# EAGLE design aop (EAGLE 6.4)
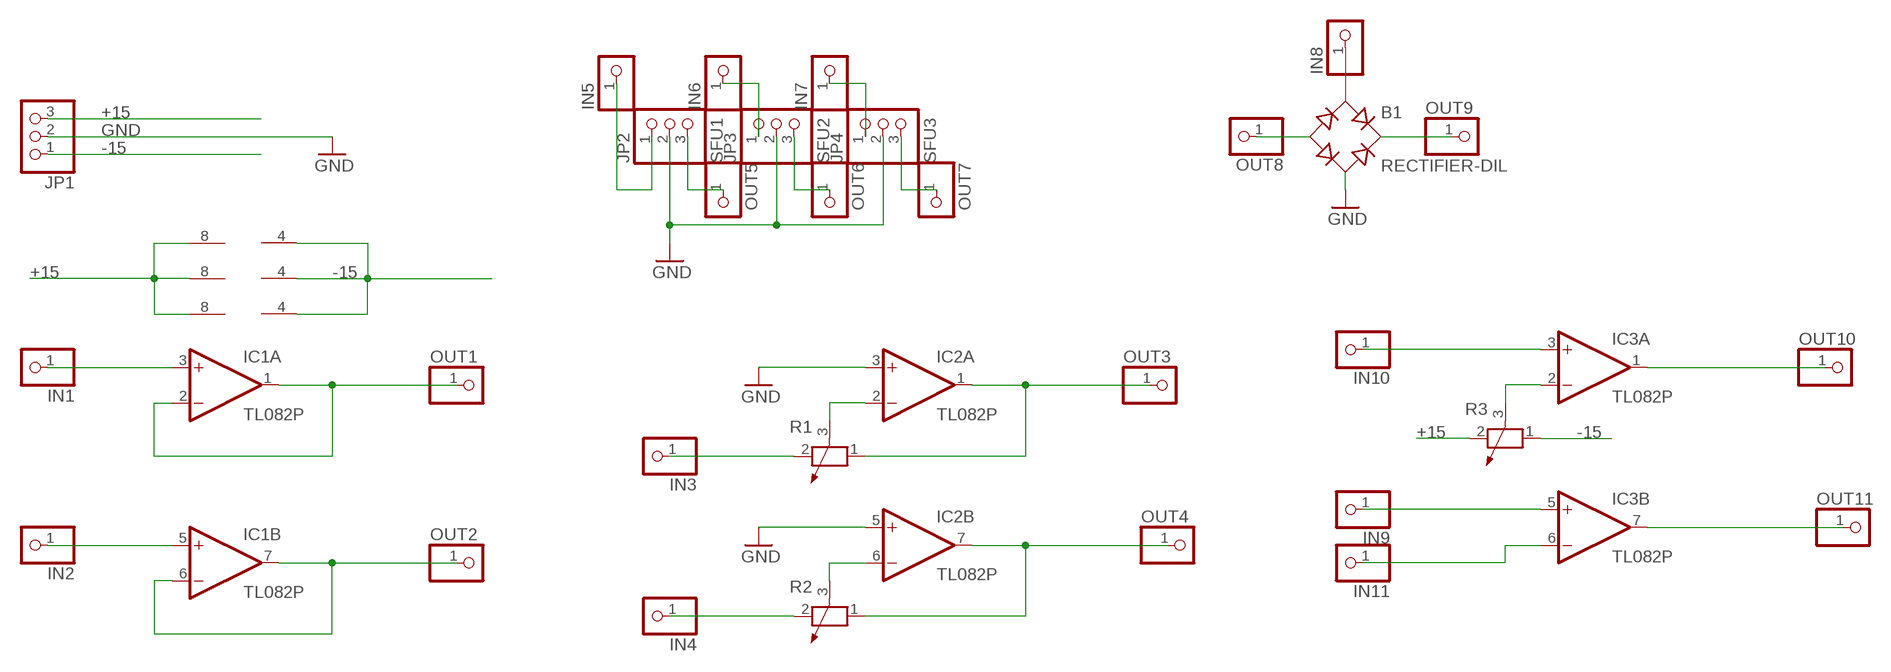
[diagram p0: schematic, sheet 1]

## Parts
B1  RECTIFIER-DIL  [B-DIL]
IC1  TL082P  [DIL08]
IC2  TL082P  [DIL08]
IC3  TL082P  [DIL08]
IN1  PINHD-1X1  [1X01]
IN2  PINHD-1X1  [1X01]
IN3  PINHD-1X1  [1X01]
IN4  PINHD-1X1  [1X01]
IN5  PINHD-1X1  [1X01]
IN6  PINHD-1X1  [1X01]
IN7  PINHD-1X1  [1X01]
IN8  PINHD-1X1  [1X01]
IN9  PINHD-1X1  [1X01]
IN10  PINHD-1X1  [1X01]
IN11  PINHD-1X1  [1X01]
JP1  PINHD-1X3  [1X03]
JP2  SFU1  PINHD-1X3  [1X03]
JP3  SFU2  PINHD-1X3  [1X03]
JP4  SFU3  PINHD-1X3  [1X03]
OUT1  PINHD-1X1  [1X01]
OUT2  PINHD-1X1  [1X01]
OUT3  PINHD-1X1  [1X01]
OUT4  PINHD-1X1  [1X01]
OUT5  PINHD-1X1  [1X01]
OUT6  PINHD-1X1  [1X01]
OUT7  PINHD-1X1  [1X01]
OUT8  PINHD-1X1  [1X01]
OUT9  PINHD-1X1  [1X01]
OUT10  PINHD-1X1  [1X01]
OUT11  PINHD-1X1  [1X01]
R1  POTENTIOMETER_PT-10  [PT-10]
R2  POTENTIOMETER_PT-10  [PT-10]
R3  POTENTIOMETER_PT-10  [PT-10]

## Nets
+15: IC1.8(P:V+) IC2.8(P:V+) IC3.8(P:V+) JP1.3 R3.2
-15: IC1.4(P:V-) IC2.4(P:V-) IC3.4(P:V-) JP1.1 R3.1
GND: B1.AC2 IC2.3(A:+IN) IC2.5(B:+IN) JP1.2 JP2.2 JP3.2 JP4.2
N$1: IC1.1(A:OUT) IC1.2(A:-IN) OUT1.1
N$2: IC1.3(A:+IN) IN1.1
N$3: IC1.5(B:+IN) IN2.1
N$4: IC1.6(B:-IN) IC1.7(B:OUT) OUT2.1
N$5: IC2.1(A:OUT) OUT3.1 R1.1
N$6: IC2.2(A:-IN) R1.3
N$7: IC2.7(B:OUT) OUT4.1 R2.1
N$8: IC2.6(B:-IN) R2.3
N$9: IN3.1 R1.2
N$10: IN4.1 R2.2
N$11: IN5.1 JP2.1
N$12: JP2.3 OUT5.1
N$13: IN6.1 JP3.1
N$14: JP3.3 OUT6.1
N$15: IN7.1 JP4.1
N$16: JP4.3 OUT7.1
N$17: B1.AC1 IN8.1
N$18: IC3.1(A:OUT) OUT10.1
N$19: B1.- OUT8.1
N$20: B1.+ OUT9.1
N$21: IC3.2(A:-IN) R3.3
N$22: IC3.7(B:OUT) OUT11.1
N$23: IC3.6(B:-IN) IN11.1
N$24: IC3.3(A:+IN) IN10.1
N$25: IC3.5(B:+IN) IN9.1

## Library data of the parts
B1 = rectifier:RECTIFIER-: Rectifier
IC1-IC3 = linear:TL082: OP AMP
IN1-IN11 OUT1-OUT11 = pinhead:PINHD-1X1: PIN HEADER
JP1-JP4 = pinhead:PINHD-1X3: PIN HEADER
R1-R3 = rcl:POTENTIOMETER_: Potentiometer

## Board
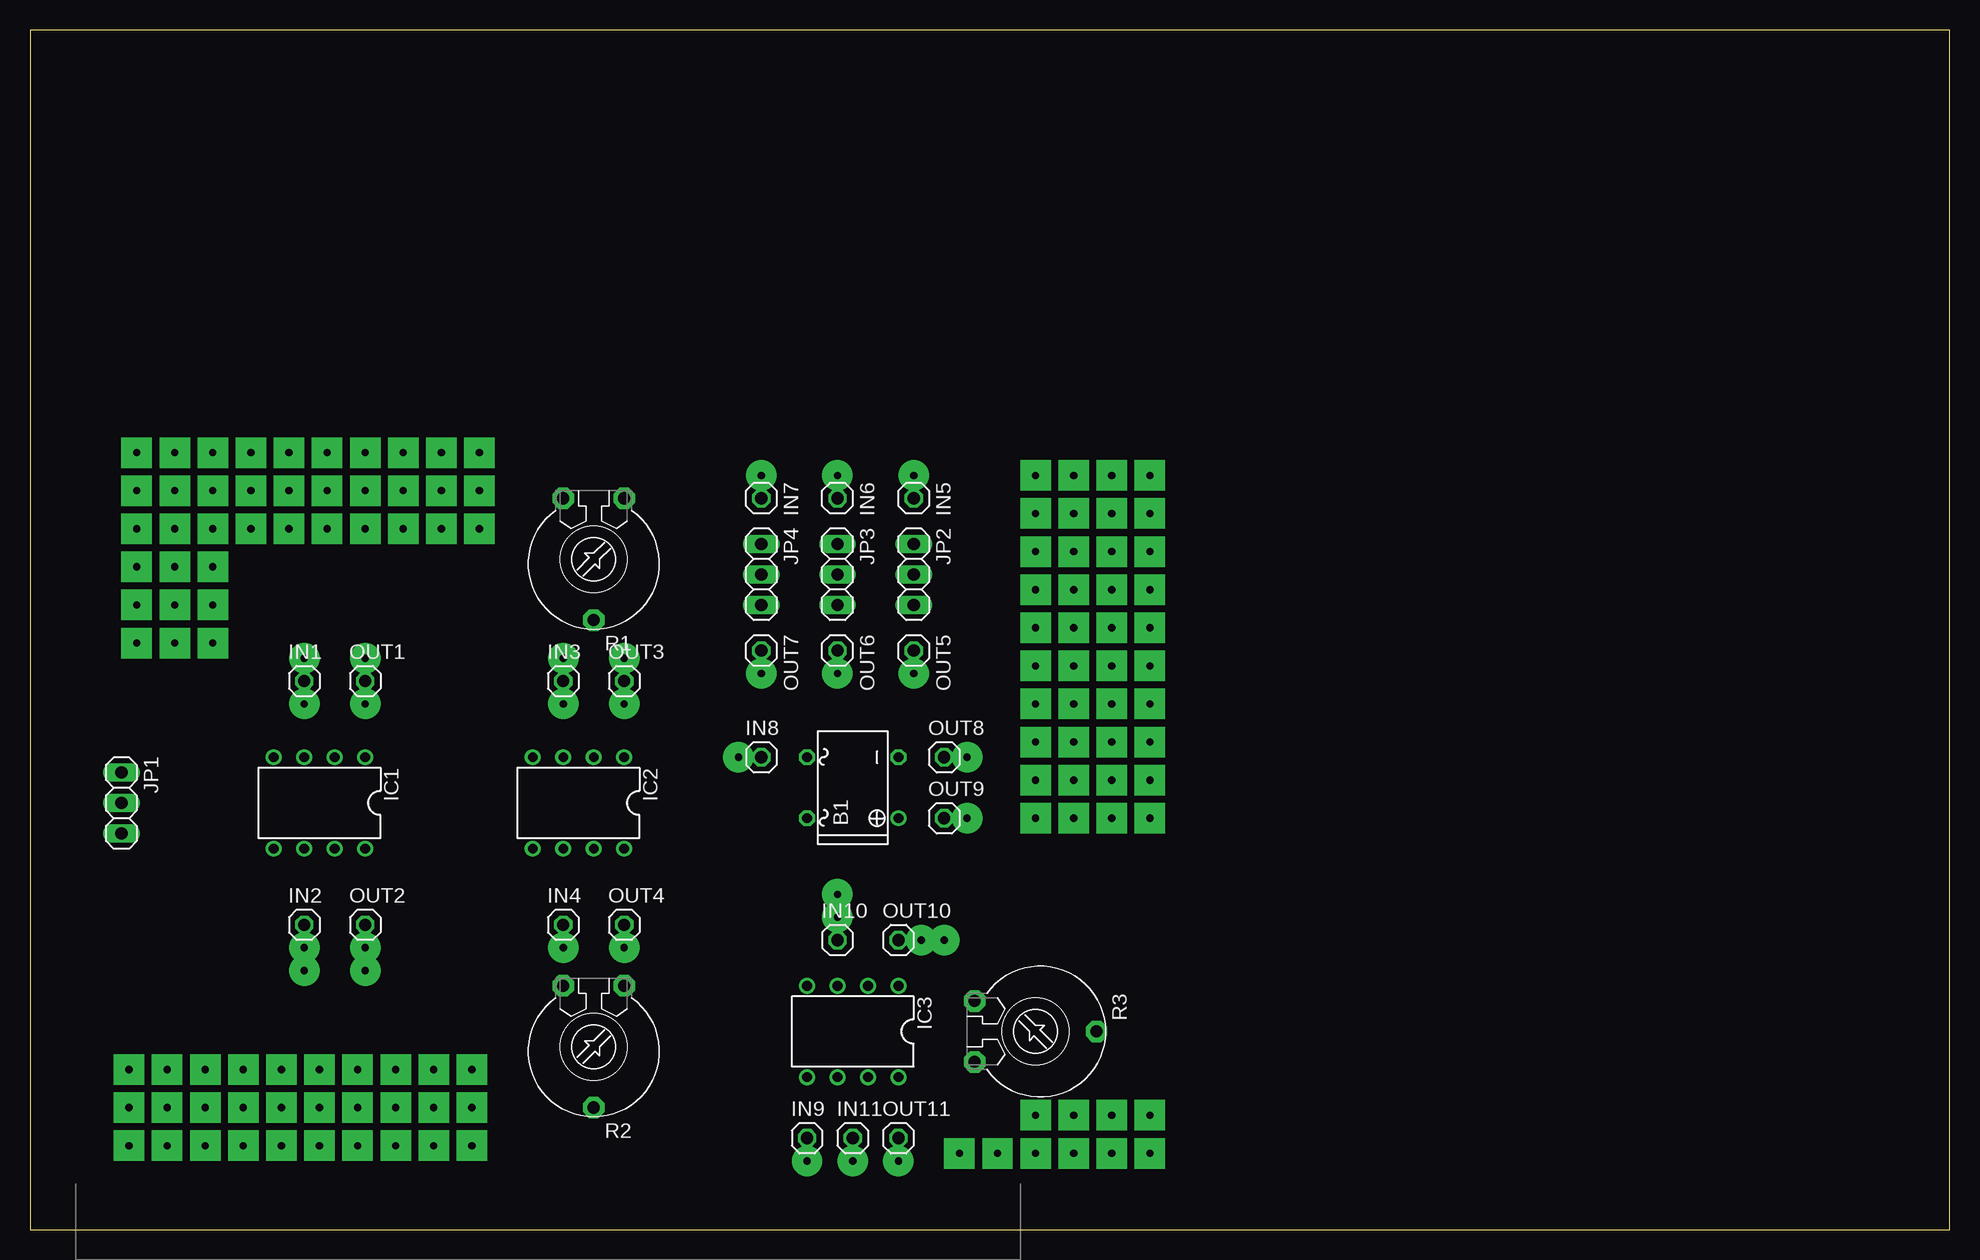
[diagram p1: board, top side]
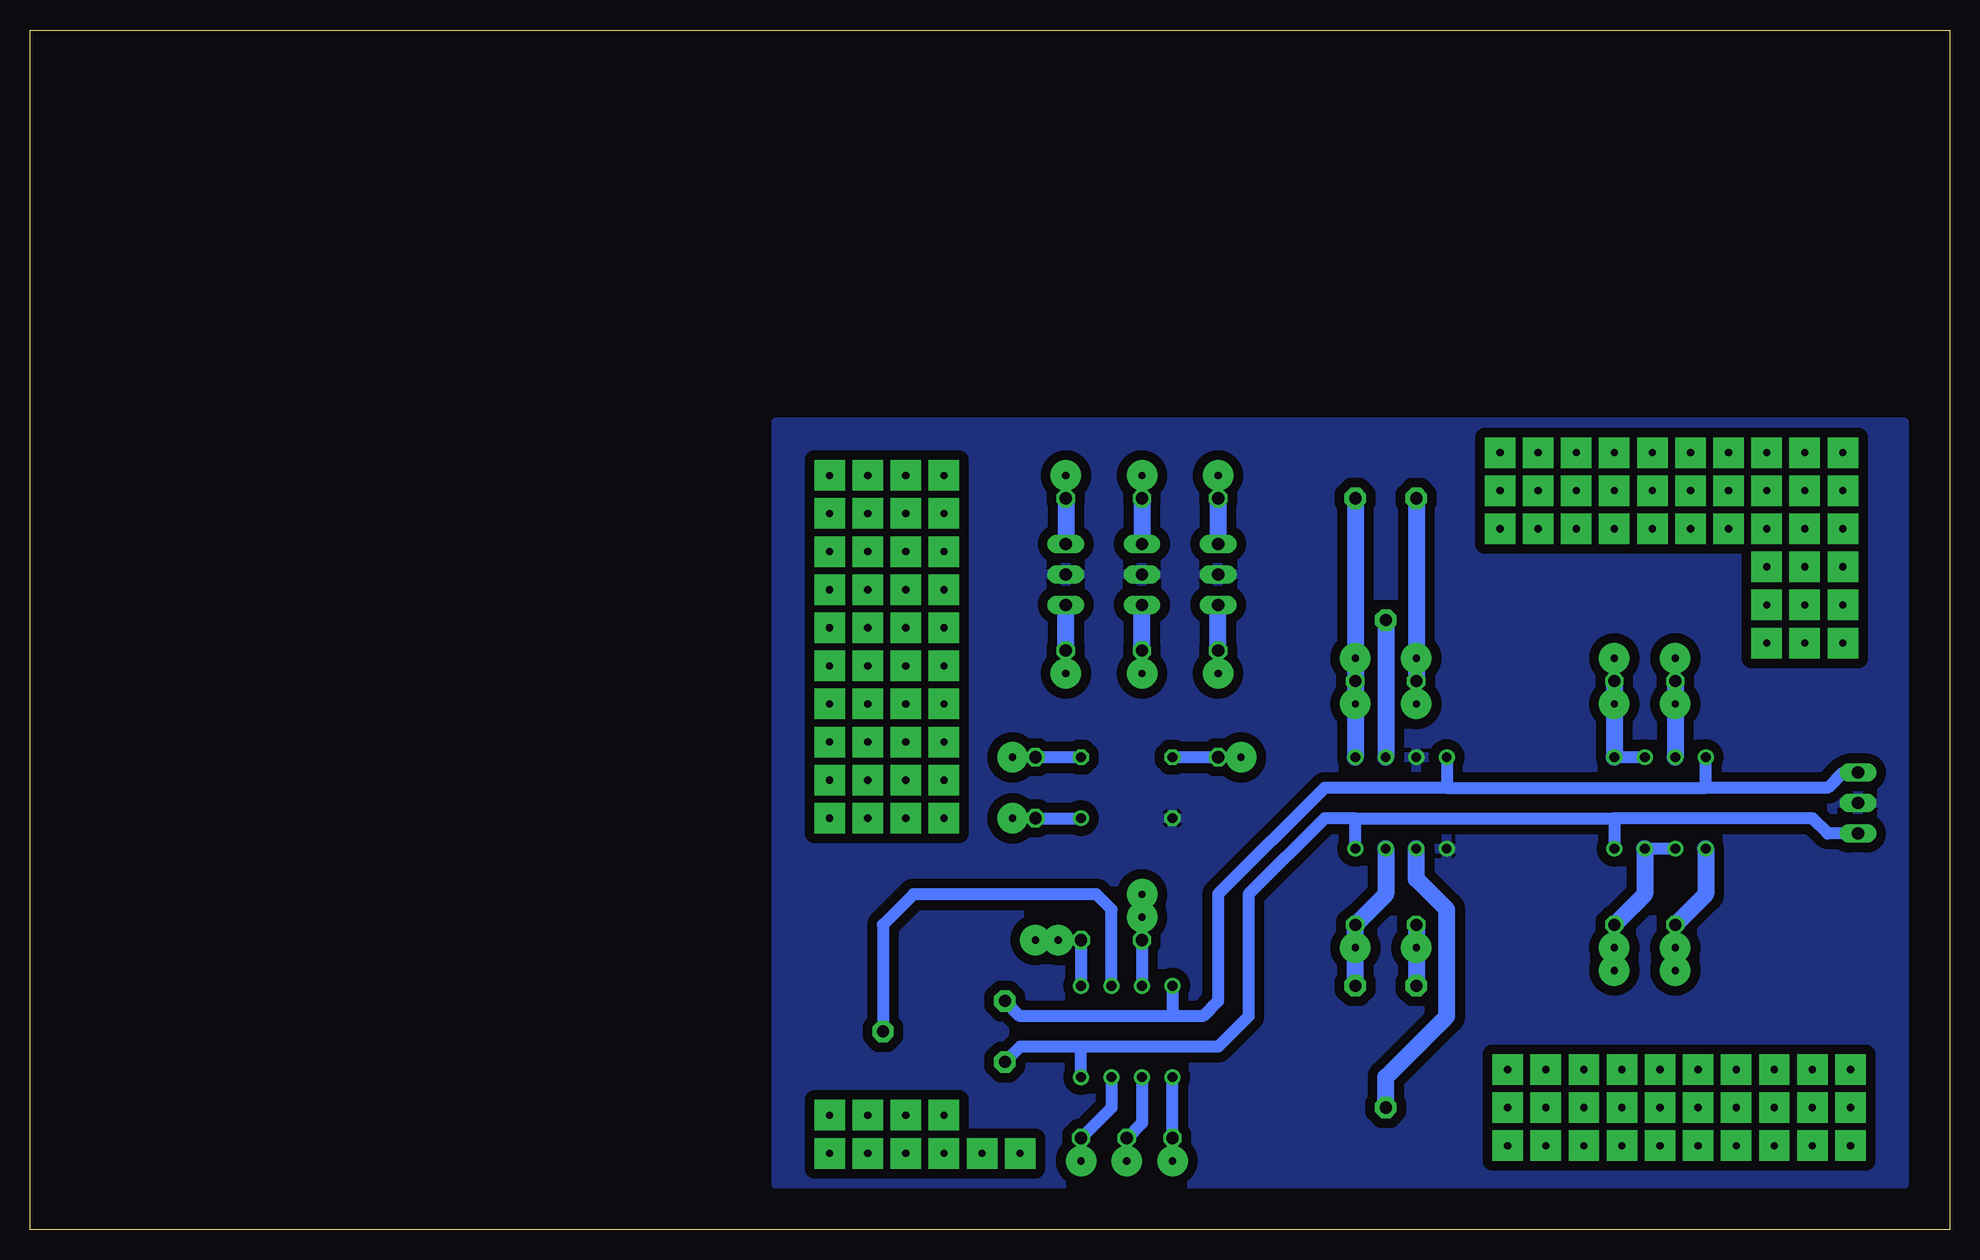
[diagram p2: board, bottom side, seen from below]

Size 160 x 100 mm. Coordinates in mm from the lower left corner, seen from the top.
Outline: 0,0 160,0 160,100 0,100 0,0
Copper layers (1*16): Top 0.035mm / dielectric 1.5mm / Bottom 0.035mm
Design rules "default": minimum track width 10mil, minimum drill 24mil, track to track 8mil, track to pad 8mil, pad to pad 8mil, via to via 8mil, smd to smd 8mil, copper to edge 40mil, drill to drill 8mil, minimum pad ring 10mil, minimum via ring 8mil, stop-mask expansion 4mil, vias tented up to drill 0mil, thermal gap 10mil

### Footprints (pad centres in the part's own frame; a part is rotated, then mirrored left to right if it is on the bottom)
B-DIL = drill 0.813: + -2.54,-3.81 | drill 0.813 octagon: - 2.54,-3.81; AC1 2.54,3.81; AC2 -2.54,3.81
DIL08 = drill 0.813 pad 1.27: 1 -3.81,-3.81; 2 -1.27,-3.81; 3 1.27,-3.81; 4 3.81,-3.81; 5 3.81,3.81; 6 1.27,3.81; 7 -1.27,3.81; 8 -3.81,3.81
1X01 = drill 1.016 octagon: 1 0,0
1X03 = drill 1.016 long: 1 -2.54,0; 2 0,0; 3 2.54,0
PT-10 = drill 1.016 pad 1.778 octagon: 1 -2.54,-5.08; 2 2.54,-5.08; 3 0,5.08

### Placement (x,y rotation side)
B1  68.58,36.83 90 top
IC1  24.13,35.56 180 top
IC2  45.72,35.56 180 top
IC3  68.58,16.51 180 top
IN1  22.86,45.72 0 top
IN2  22.86,25.4 0 top
IN3  44.45,45.72 0 top
IN4  44.45,25.4 0 top
IN5  73.66,60.96 270 top
IN6  67.31,60.96 270 top
IN7  60.96,60.96 270 top
IN8  60.96,39.37 0 top
IN9  64.77,7.62 0 top
IN10  67.31,24.13 0 top
IN11  68.58,7.62 0 top
JP1  7.62,35.56 270 top
JP2  73.66,54.61 270 top
JP3  67.31,54.61 270 top
JP4  60.96,54.61 270 top
OUT1  27.94,45.72 0 top
OUT2  27.94,25.4 0 top
OUT3  49.53,45.72 0 top
OUT4  49.53,25.4 0 top
OUT5  73.66,48.26 270 top
OUT6  67.31,48.26 270 top
OUT7  60.96,48.26 270 top
OUT8  76.2,39.37 0 top
OUT9  76.2,34.29 0 top
OUT10  72.39,24.13 0 top
OUT11  72.39,7.62 0 top
R1  46.99,55.88 180 top
R2  46.99,15.24 180 top
R3  83.82,16.51 270 top

### Tracks (layer width: path | path; a pad name or v marks a point on that pad's centre or on a via)
+15
  Bottom 1.016: JP1.3 10.16,33.02 11.43,34.29 27.94,34.29 | 27.94,34.29 IC1.8 | 49.53,34.29 27.94,34.29 | IC2.8 49.53,34.29 | 49.53,34.29 52.07,34.29 58.42,27.94 58.42,17.78 60.96,15.24 72.39,15.24 | IC3.8 72.39,15.24 | 72.39,15.24 77.47,15.24 R3.2
-15
  Bottom 1.016: JP1.1 8.89,38.1 10.16,36.83 20.32,36.83 | 20.32,36.83 IC1.4 | IC2.4 41.91,36.83 | 41.91,36.83 20.32,36.83 | 41.91,36.83 52.07,36.83 60.96,27.94 60.96,19.05 62.23,17.78 64.77,17.78 | IC3.4 64.77,17.78 | 64.77,17.78 77.47,17.78 R3.1
GND
  pour Bottom (isolate 0.813): 3.81,67.31 3.81,3.81 97.79,3.81 97.79,67.31
N$1
  Bottom 1.016: IC1.2 IC1.1
  Bottom 1.422: OUT1.1 IC1.1
N$2
  Bottom 1.422: IN1.1 IC1.3
N$3
  Bottom 1.422: IC1.5 20.32,27.94 IN2.1
N$4
  Bottom 1.016: IC1.6 IC1.7
  Bottom 1.422: IC1.7 25.4,27.94 OUT2.1
N$5  (via drill 0.6 pad 2.54)
  Bottom 1.422: IC2.1 v49.53,43.81 OUT3.1 v49.53,47.62 R1.1
N$6
  Bottom 1.422: R1.3 IC2.2
N$7  (via drill 0.6 pad 2.54)
  Bottom 1.422: R2.1 v49.53,23.5 OUT4.1 46.99,27.94 IC2.7
N$8
  Bottom 1.422: R2.3 46.99,12.7 41.91,17.78 41.91,26.67 44.45,29.21 IC2.6
N$9  (via drill 0.6 pad 2.54)
  Bottom 1.422: R1.2 v44.45,47.62 IN3.1
N$10  (via drill 0.6 pad 2.54)
  Bottom 1.422: IN4.1 v44.45,23.5 R2.2
N$11
  Bottom 1.422: IN5.1 JP2.1
N$12
  Bottom 1.422: OUT5.1 JP2.3
N$13
  Bottom 1.422: IN6.1 JP3.1
N$14
  Bottom 1.422: OUT6.1 JP3.3
N$15
  Bottom 1.422: IN7.1 JP4.1
N$16
  Bottom 1.422: OUT7.1 JP4.3
N$17
  Bottom 1.016: IN8.1 B1.AC1
N$18
  Bottom 1.016: OUT10.1 IC3.1
N$19
  Bottom 1.016: B1.- OUT8.1
N$20
  Bottom 1.016: OUT9.1 B1.+
N$21
  Bottom 1.016: IC3.2 69.85,26.67 71.12,27.94 86.36,27.94 88.9,25.4 R3.3
N$22
  Bottom 1.016: IC3.7 69.85,10.16 OUT11.1
N$23
  Bottom 1.016: IC3.6 67.31,8.89 IN11.1
N$24
  Bottom 1.016: IN10.1 IC3.3
N$25
  Bottom 1.016: IN9.1 IC3.5
N$26  (via drill 0.6 pad 2.54)
  other vias: 22.86,47.62
N$27  (via drill 0.6 pad 2.54)
  other vias: 22.86,43.81
N$28  (via drill 0.6 pad 2.54)
  other vias: 27.94,47.62
N$29  (via drill 0.6 pad 2.54)
  other vias: 27.94,43.81
N$30  (via drill 0.6 pad 2.54)
  other vias: 22.86,23.5
N$31  (via drill 0.6 pad 2.54)
  other vias: 22.86,21.59
N$32  (via drill 0.6 pad 2.54)
  other vias: 27.94,23.5
N$33  (via drill 0.6 pad 2.54)
  other vias: 27.94,21.59
N$34  (via drill 0.6 pad 2.54)
  other vias: 44.45,43.81
N$35  (via drill 0.6 pad 2.54)
  other vias: 60.96,62.87
N$36  (via drill 0.6 pad 2.54)
  other vias: 67.31,62.87
N$37  (via drill 0.6 pad 2.54)
  other vias: 73.66,62.87
N$38  (via drill 0.6 pad 2.54)
  other vias: 60.96,46.35
N$39  (via drill 0.6 pad 2.54)
  other vias: 67.31,46.35
N$40  (via drill 0.6 pad 2.54)
  other vias: 73.66,46.35
N$41  (via drill 0.6 pad 2.54)
  other vias: 59.05,39.37
N$42  (via drill 0.6 pad 2.54)
  other vias: 78.11,39.37
N$43  (via drill 0.6 pad 2.54)
  other vias: 78.11,34.29
N$44  (via drill 0.6 pad 2.54)
  other vias: 67.31,26.04
N$45  (via drill 0.6 pad 2.54)
  other vias: 67.31,27.94
N$46  (via drill 0.6 pad 2.54)
  other vias: 74.3,24.13
N$47  (via drill 0.6 pad 2.54)
  other vias: 76.2,24.13
N$48  (via drill 0.6 pad 2.54)
  other vias: 64.77,5.71
N$49  (via drill 0.6 pad 2.54)
  other vias: 68.58,5.71
N$50  (via drill 0.6 pad 2.54)
  other vias: 72.39,5.71
N$52  (via drill 0.6 pad 2.54)
  other vias: 77.47,6.35
N$53  (via drill 0.6 pad 2.54)
  other vias: 80.64,6.35
N$55  (via drill 0.6 pad 2.54)
  other vias: 83.82,9.53
N$56  (via drill 0.6 pad 2.54)
  other vias: 83.82,6.35
N$57  (via drill 0.6 pad 2.54)
  other vias: 87,6.35
N$58  (via drill 0.6 pad 2.54)
  other vias: 87,9.53
N$59  (via drill 0.6 pad 2.54)
  other vias: 90.17,9.53
N$60  (via drill 0.6 pad 2.54)
  other vias: 90.17,6.35
N$61  (via drill 0.6 pad 2.54)
  other vias: 93.34,6.35
N$62  (via drill 0.6 pad 2.54)
  other vias: 93.34,9.53
N$63  (via drill 0.6 pad 2.54)
  other vias: 93.34,62.87
N$64  (via drill 0.6 pad 2.54)
  other vias: 93.34,59.69
N$65  (via drill 0.6 pad 2.54)
  other vias: 93.34,56.52
N$66  (via drill 0.6 pad 2.54)
  other vias: 93.34,53.34
N$67  (via drill 0.6 pad 2.54)
  other vias: 93.34,50.16
N$68  (via drill 0.6 pad 2.54)
  other vias: 93.34,46.99
N$69  (via drill 0.6 pad 2.54)
  other vias: 93.34,43.81
N$70  (via drill 0.6 pad 2.54)
  other vias: 90.17,62.87
N$71  (via drill 0.6 pad 2.54)
  other vias: 90.17,59.69
N$72  (via drill 0.6 pad 2.54)
  other vias: 90.17,56.52
N$73  (via drill 0.6 pad 2.54)
  other vias: 90.17,53.34
N$74  (via drill 0.6 pad 2.54)
  other vias: 90.17,50.16
N$75  (via drill 0.6 pad 2.54)
  other vias: 90.17,46.99
N$76  (via drill 0.6 pad 2.54)
  other vias: 90.17,43.81
N$77  (via drill 0.6 pad 2.54)
  other vias: 87,62.87
N$78  (via drill 0.6 pad 2.54)
  other vias: 87,59.69
N$79  (via drill 0.6 pad 2.54)
  other vias: 87,56.52
N$80  (via drill 0.6 pad 2.54)
  other vias: 87,53.34
N$81  (via drill 0.6 pad 2.54)
  other vias: 87,50.16
N$82  (via drill 0.6 pad 2.54)
  other vias: 87,46.99
N$83  (via drill 0.6 pad 2.54)
  other vias: 87,43.81
N$84  (via drill 0.6 pad 2.54)
  other vias: 83.82,62.87
N$85  (via drill 0.6 pad 2.54)
  other vias: 83.82,59.69
N$86  (via drill 0.6 pad 2.54)
  other vias: 83.82,56.52
N$87  (via drill 0.6 pad 2.54)
  other vias: 83.82,53.34
N$88  (via drill 0.6 pad 2.54)
  other vias: 83.82,50.16
N$89  (via drill 0.6 pad 2.54)
  other vias: 83.82,46.99
N$90  (via drill 0.6 pad 2.54)
  other vias: 83.82,43.81
N$91  (via drill 0.6 pad 2.54)
  other vias: 93.34,40.64
N$92  (via drill 0.6 pad 2.54)
  other vias: 93.34,37.47
N$93  (via drill 0.6 pad 2.54)
  other vias: 93.34,34.29
N$94  (via drill 0.6 pad 2.54)
  other vias: 90.17,40.64
N$95  (via drill 0.6 pad 2.54)
  other vias: 90.17,37.47
N$96  (via drill 0.6 pad 2.54)
  other vias: 90.17,34.29
N$97  (via drill 0.6 pad 2.54)
  other vias: 87,40.64
N$98  (via drill 0.6 pad 2.54)
  other vias: 87,37.47
N$99  (via drill 0.6 pad 2.54)
  other vias: 87,34.29
N$100  (via drill 0.6 pad 2.54)
  other vias: 83.82,40.64
N$101  (via drill 0.6 pad 2.54)
  other vias: 83.82,37.47
N$102  (via drill 0.6 pad 2.54)
  other vias: 83.82,34.29
N$103  (via drill 0.6 pad 2.54)
  other vias: 15.24,64.77
N$104  (via drill 0.6 pad 2.54)
  other vias: 15.24,61.59
N$105  (via drill 0.6 pad 2.54)
  other vias: 15.24,58.42
N$106  (via drill 0.6 pad 2.54)
  other vias: 12.06,64.77
N$107  (via drill 0.6 pad 2.54)
  other vias: 12.06,61.59
N$108  (via drill 0.6 pad 2.54)
  other vias: 12.06,58.42
N$109  (via drill 0.6 pad 2.54)
  other vias: 8.89,64.77
N$110  (via drill 0.6 pad 2.54)
  other vias: 8.89,61.59
N$111  (via drill 0.6 pad 2.54)
  other vias: 8.89,58.42
N$112  (via drill 0.6 pad 2.54)
  other vias: 14.61,13.34
N$113  (via drill 0.6 pad 2.54)
  other vias: 14.61,10.16
N$114  (via drill 0.6 pad 2.54)
  other vias: 14.61,6.99
N$115  (via drill 0.6 pad 2.54)
  other vias: 15.24,55.24
N$116  (via drill 0.6 pad 2.54)
  other vias: 15.24,52.07
N$117  (via drill 0.6 pad 2.54)
  other vias: 15.24,48.9
N$118  (via drill 0.6 pad 2.54)
  other vias: 12.06,55.24
N$119  (via drill 0.6 pad 2.54)
  other vias: 12.06,52.07
N$120  (via drill 0.6 pad 2.54)
  other vias: 12.06,48.9
N$121  (via drill 0.6 pad 2.54)
  other vias: 8.89,55.24
N$122  (via drill 0.6 pad 2.54)
  other vias: 8.89,52.07
N$123  (via drill 0.6 pad 2.54)
  other vias: 8.89,48.9
N$124  (via drill 0.6 pad 2.54)
  other vias: 11.43,13.34
N$125  (via drill 0.6 pad 2.54)
  other vias: 11.43,10.16
N$126  (via drill 0.6 pad 2.54)
  other vias: 11.43,6.99
N$127  (via drill 0.6 pad 2.54)
  other vias: 27.94,64.77
N$128  (via drill 0.6 pad 2.54)
  other vias: 27.94,61.59
N$129  (via drill 0.6 pad 2.54)
  other vias: 27.94,58.42
N$130  (via drill 0.6 pad 2.54)
  other vias: 24.77,64.77
N$131  (via drill 0.6 pad 2.54)
  other vias: 24.77,61.59
N$132  (via drill 0.6 pad 2.54)
  other vias: 24.77,58.42
N$133  (via drill 0.6 pad 2.54)
  other vias: 21.59,64.77
N$134  (via drill 0.6 pad 2.54)
  other vias: 21.59,61.59
N$135  (via drill 0.6 pad 2.54)
  other vias: 21.59,58.42
N$136  (via drill 0.6 pad 2.54)
  other vias: 18.41,64.77
N$137  (via drill 0.6 pad 2.54)
  other vias: 18.41,61.59
N$138  (via drill 0.6 pad 2.54)
  other vias: 18.41,58.42
N$139  (via drill 0.6 pad 2.54)
  other vias: 8.26,13.34
N$140  (via drill 0.6 pad 2.54)
  other vias: 8.26,10.16
N$141  (via drill 0.6 pad 2.54)
  other vias: 8.26,6.99
N$142  (via drill 0.6 pad 2.54)
  other vias: 37.47,64.77
N$143  (via drill 0.6 pad 2.54)
  other vias: 37.47,61.59
N$144  (via drill 0.6 pad 2.54)
  other vias: 37.47,58.42
N$145  (via drill 0.6 pad 2.54)
  other vias: 34.29,64.77
N$146  (via drill 0.6 pad 2.54)
  other vias: 34.29,61.59
N$147  (via drill 0.6 pad 2.54)
  other vias: 34.29,58.42
N$148  (via drill 0.6 pad 2.54)
  other vias: 31.11,64.77
N$149  (via drill 0.6 pad 2.54)
  other vias: 31.11,61.59
N$150  (via drill 0.6 pad 2.54)
  other vias: 31.11,58.42
N$151  (via drill 0.6 pad 2.54)
  other vias: 27.3,13.34
N$152  (via drill 0.6 pad 2.54)
  other vias: 27.3,10.16
N$153  (via drill 0.6 pad 2.54)
  other vias: 27.3,6.99
N$154  (via drill 0.6 pad 2.54)
  other vias: 24.13,13.34
N$155  (via drill 0.6 pad 2.54)
  other vias: 24.13,10.16
N$156  (via drill 0.6 pad 2.54)
  other vias: 24.13,6.99
N$157  (via drill 0.6 pad 2.54)
  other vias: 20.95,13.34
N$158  (via drill 0.6 pad 2.54)
  other vias: 20.95,10.16
N$159  (via drill 0.6 pad 2.54)
  other vias: 20.95,6.99
N$160  (via drill 0.6 pad 2.54)
  other vias: 17.78,13.34
N$161  (via drill 0.6 pad 2.54)
  other vias: 17.78,10.16
N$162  (via drill 0.6 pad 2.54)
  other vias: 17.78,6.99
N$163  (via drill 0.6 pad 2.54)
  other vias: 36.83,13.34
N$164  (via drill 0.6 pad 2.54)
  other vias: 36.83,10.16
N$165  (via drill 0.6 pad 2.54)
  other vias: 36.83,6.99
N$166  (via drill 0.6 pad 2.54)
  other vias: 33.66,13.34
N$167  (via drill 0.6 pad 2.54)
  other vias: 33.66,10.16
N$168  (via drill 0.6 pad 2.54)
  other vias: 33.66,6.99
N$169  (via drill 0.6 pad 2.54)
  other vias: 30.48,13.34
N$170  (via drill 0.6 pad 2.54)
  other vias: 30.48,10.16
N$171  (via drill 0.6 pad 2.54)
  other vias: 30.48,6.99